# Altium schematic sheet Tm1637.SchDoc
size A; SheetNumber: 4; SheetTotal: 4
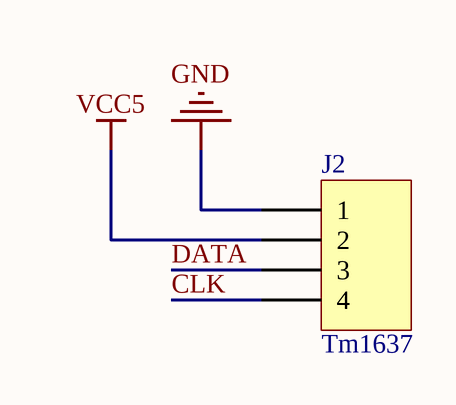
[diagram p0: Tm1637.SchDoc]

## Parts
J2  Tm1637  [CON WF_4]

## Nets
GND: J2.1
VCC5: J2.2
CLK: J2.4
DATA: J2.3

## Library data of the parts
J2 = Header 4 PIN Telecom.: Header, 4-Pin Telecom.; Designer: Abbas Basereh; Data: 16-12-2016; Link: *; Part. No: *